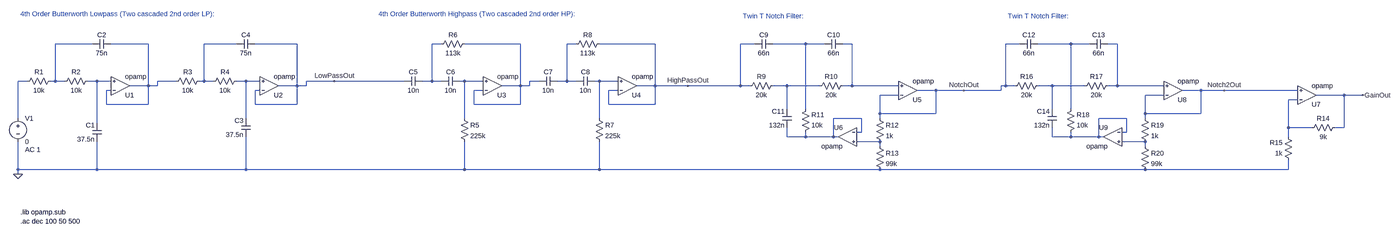
[diagram p0: schematic BMERobotics4thOrderNotch.asc, whole sheet]
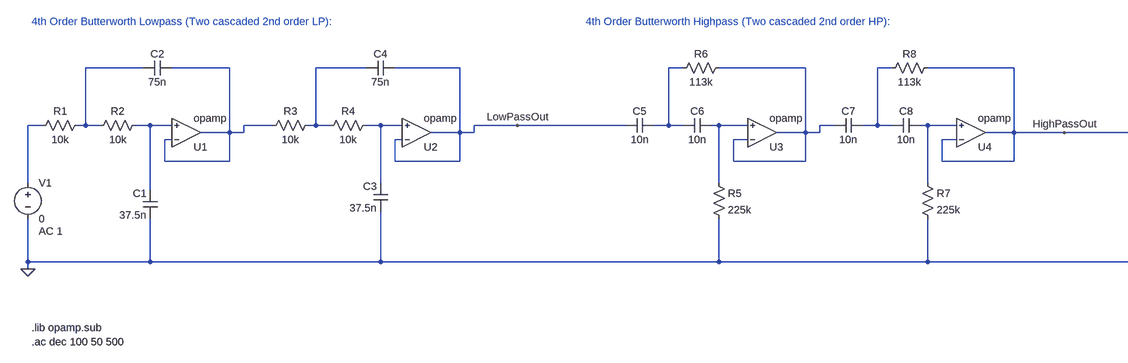
[diagram p1: schematic BMERobotics4thOrderNotch.asc, part, row 1 of 1, column 1 of 2]
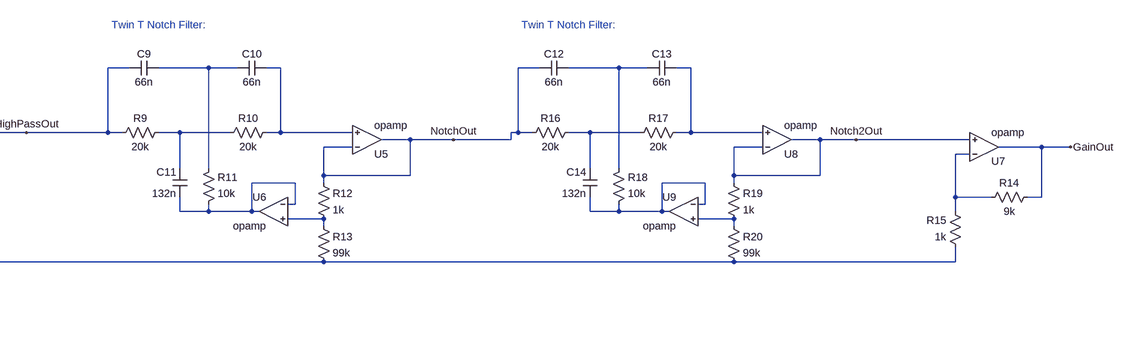
[diagram p2: schematic BMERobotics4thOrderNotch.asc, part, row 1 of 1, column 2 of 2]
BMERobotics4thOrderNotch.asc, the LTspice schematic file:
Version 4
SHEET 1 4608 1124
WIRE 0 0 -128 0
WIRE 192 0 64 0
WIRE 496 0 384 0
WIRE 704 0 560 0
WIRE 1200 0 1168 0
WIRE 1472 0 1280 0
WIRE 1664 0 1632 0
WIRE 1936 0 1744 0
WIRE 2384 0 2336 0
WIRE 2560 0 2448 0
WIRE 2624 0 2560 0
WIRE 2720 0 2688 0
WIRE 3296 0 3248 0
WIRE 3472 0 3360 0
WIRE 3536 0 3472 0
WIRE 3632 0 3600 0
WIRE -224 128 -256 128
WIRE -128 128 -128 0
WIRE -128 128 -144 128
WIRE -96 128 -128 128
WIRE 16 128 -16 128
WIRE 64 128 16 128
WIRE 288 128 224 128
WIRE 384 128 384 0
WIRE 384 128 368 128
WIRE 416 128 384 128
WIRE 528 128 496 128
WIRE 576 128 528 128
WIRE 832 128 736 128
WIRE 1072 128 832 128
WIRE 1168 128 1168 0
WIRE 1168 128 1136 128
WIRE 1200 128 1168 128
WIRE 1280 128 1264 128
WIRE 1344 128 1280 128
WIRE 1536 128 1504 128
WIRE 1632 128 1632 0
WIRE 1632 128 1600 128
WIRE 1664 128 1632 128
WIRE 1744 128 1728 128
WIRE 1808 128 1744 128
WIRE 192 144 192 0
WIRE 192 144 128 144
WIRE 224 144 224 128
WIRE 224 144 192 144
WIRE 704 144 704 0
WIRE 704 144 640 144
WIRE 736 144 736 128
WIRE 736 144 704 144
WIRE 1472 144 1472 0
WIRE 1472 144 1408 144
WIRE 1504 144 1504 128
WIRE 1504 144 1472 144
WIRE 1936 144 1936 0
WIRE 1936 144 1872 144
WIRE 2048 144 1936 144
WIRE 2336 144 2336 0
WIRE 2336 144 2048 144
WIRE 2368 144 2336 144
WIRE 2496 144 2448 144
WIRE 2608 144 2496 144
WIRE 2720 144 2720 0
WIRE 2720 144 2688 144
WIRE 2880 144 2720 144
WIRE 3248 144 3248 0
WIRE 3248 144 3232 144
WIRE 3280 144 3248 144
WIRE 3408 144 3360 144
WIRE 3520 144 3408 144
WIRE 3632 144 3632 0
WIRE 3632 144 3600 144
WIRE 3792 144 3632 144
WIRE 64 160 48 160
WIRE 576 160 560 160
WIRE 1344 160 1312 160
WIRE 1808 160 1776 160
WIRE 3008 160 2944 160
WIRE 3104 160 3008 160
WIRE 3232 160 3232 144
WIRE 3232 160 3104 160
WIRE 3920 160 3856 160
WIRE 4000 160 3920 160
WIRE 4256 160 4000 160
WIRE 2880 176 2816 176
WIRE 3792 176 3728 176
WIRE 4416 176 4320 176
WIRE 4480 176 4416 176
WIRE 4256 192 4224 192
WIRE 48 208 48 160
WIRE 192 208 192 144
WIRE 192 208 48 208
WIRE 560 208 560 160
WIRE 704 208 704 144
WIRE 704 208 560 208
WIRE 1312 208 1312 160
WIRE 1472 208 1472 144
WIRE 1472 208 1312 208
WIRE 1776 208 1776 160
WIRE 1936 208 1936 144
WIRE 1936 208 1776 208
WIRE 2496 224 2496 144
WIRE 2560 224 2560 0
WIRE 3408 224 3408 144
WIRE 3472 224 3472 0
WIRE 2816 240 2816 176
WIRE 3008 240 3008 160
WIRE 3008 240 2816 240
WIRE 3728 240 3728 176
WIRE 3920 240 3920 160
WIRE 3920 240 3728 240
WIRE -256 256 -256 128
WIRE 528 256 528 128
WIRE 1280 256 1280 128
WIRE 1744 256 1744 128
WIRE 2752 256 2656 256
WIRE 2816 256 2816 240
WIRE 3664 256 3568 256
WIRE 3728 256 3728 240
WIRE 16 272 16 128
WIRE 4224 288 4224 192
WIRE 4304 288 4224 288
WIRE 4416 288 4416 176
WIRE 4416 288 4384 288
WIRE 2752 304 2752 256
WIRE 2752 304 2736 304
WIRE 3664 304 3664 256
WIRE 3664 304 3648 304
WIRE 2496 320 2496 288
WIRE 2560 320 2560 304
WIRE 2560 320 2496 320
WIRE 2656 320 2656 256
WIRE 2656 320 2560 320
WIRE 2672 320 2656 320
WIRE 3408 320 3408 288
WIRE 3472 320 3472 304
WIRE 3472 320 3408 320
WIRE 3568 320 3568 256
WIRE 3568 320 3472 320
WIRE 3584 320 3568 320
WIRE 4224 320 4224 288
WIRE 2816 336 2736 336
WIRE 3728 336 3648 336
WIRE 2816 352 2816 336
WIRE 3728 352 3728 336
WIRE -256 432 -256 336
WIRE 16 432 16 336
WIRE 16 432 -256 432
WIRE 528 432 528 320
WIRE 528 432 16 432
WIRE 1280 432 1280 336
WIRE 1280 432 528 432
WIRE 1744 432 1744 336
WIRE 1744 432 1280 432
WIRE 2816 432 1744 432
WIRE 3728 432 2816 432
WIRE 4224 432 4224 400
WIRE 4224 432 3728 432
WIRE -256 448 -256 432
FLAG -256 448 0
FLAG 832 128 LowPassOut
FLAG 2048 144 HighPassOut
FLAG 3104 160 NotchOut
FLAG 4480 176 GainOut
FLAG 4000 160 Notch2Out
SYMBOL cap 32 336 R180
WINDOW 0 24 56 Left 2
WINDOW 3 24 8 Left 2
SYMATTR InstName C1
SYMATTR Value 37.5n
SYMBOL cap 64 -16 R90
WINDOW 0 0 32 VBottom 2
WINDOW 3 32 32 VTop 2
SYMATTR InstName C2
SYMATTR Value 75n
SYMBOL voltage -256 240 R0
WINDOW 123 24 124 Left 2
WINDOW 39 0 0 Left 0
SYMATTR Value2 AC 1
SYMATTR InstName V1
SYMATTR Value 0
SYMBOL OpAmps\\opamp 96 208 M180
SYMATTR InstName U1
SYMBOL res -128 112 R90
WINDOW 0 0 56 VBottom 2
WINDOW 3 32 56 VTop 2
SYMATTR InstName R1
SYMATTR Value 10k
SYMBOL res 0 112 R90
WINDOW 0 0 56 VBottom 2
WINDOW 3 32 56 VTop 2
SYMATTR InstName R2
SYMATTR Value 10k
SYMBOL cap 544 320 R180
WINDOW 0 24 56 Left 2
WINDOW 3 24 8 Left 2
SYMATTR InstName C3
SYMATTR Value 37.5n
SYMBOL cap 560 -16 R90
WINDOW 0 0 32 VBottom 2
WINDOW 3 32 32 VTop 2
SYMATTR InstName C4
SYMATTR Value 75n
SYMBOL OpAmps\\opamp 608 208 M180
SYMATTR InstName U2
SYMBOL res 384 112 R90
WINDOW 0 0 56 VBottom 2
WINDOW 3 32 56 VTop 2
SYMATTR InstName R3
SYMATTR Value 10k
SYMBOL res 512 112 R90
WINDOW 0 0 56 VBottom 2
WINDOW 3 32 56 VTop 2
SYMATTR InstName R4
SYMATTR Value 10k
SYMBOL cap 1136 112 R90
WINDOW 0 0 32 VBottom 2
WINDOW 3 32 32 VTop 2
SYMATTR InstName C5
SYMATTR Value 10n
SYMBOL cap 1264 112 R90
WINDOW 0 0 32 VBottom 2
WINDOW 3 32 32 VTop 2
SYMATTR InstName C6
SYMATTR Value 10n
SYMBOL OpAmps\\opamp 1376 208 M180
SYMATTR InstName U3
SYMBOL res 1264 240 R0
SYMATTR InstName R5
SYMATTR Value 225k
SYMBOL res 1296 -16 R90
WINDOW 0 0 56 VBottom 2
WINDOW 3 32 56 VTop 2
SYMATTR InstName R6
SYMATTR Value 113k
SYMBOL cap 1600 112 R90
WINDOW 0 0 32 VBottom 2
WINDOW 3 32 32 VTop 2
SYMATTR InstName C7
SYMATTR Value 10n
SYMBOL cap 1728 112 R90
WINDOW 0 0 32 VBottom 2
WINDOW 3 32 32 VTop 2
SYMATTR InstName C8
SYMATTR Value 10n
SYMBOL OpAmps\\opamp 1840 208 M180
SYMATTR InstName U4
SYMBOL res 1728 240 R0
SYMATTR InstName R7
SYMATTR Value 225k
SYMBOL res 1760 -16 R90
WINDOW 0 0 56 VBottom 2
WINDOW 3 32 56 VTop 2
SYMATTR InstName R8
SYMATTR Value 113k
SYMBOL cap 2448 -16 R90
WINDOW 0 0 32 VBottom 2
WINDOW 3 32 32 VTop 2
SYMATTR InstName C9
SYMATTR Value 66n
SYMBOL cap 2688 -16 R90
WINDOW 0 0 32 VBottom 2
WINDOW 3 32 32 VTop 2
SYMATTR InstName C10
SYMATTR Value 66n
SYMBOL cap 2512 288 R180
WINDOW 0 24 56 Left 2
WINDOW 3 24 8 Left 2
SYMATTR InstName C11
SYMATTR Value 132n
SYMBOL res 2464 128 R90
WINDOW 0 0 56 VBottom 2
WINDOW 3 32 56 VTop 2
SYMATTR InstName R9
SYMATTR Value 20k
SYMBOL res 2704 128 R90
WINDOW 0 0 56 VBottom 2
WINDOW 3 32 56 VTop 2
SYMATTR InstName R10
SYMATTR Value 20k
SYMBOL res 2544 320 M180
WINDOW 0 36 76 Left 2
WINDOW 3 36 40 Left 2
SYMATTR InstName R11
SYMATTR Value 10k
SYMBOL res 2800 240 R0
SYMATTR InstName R12
SYMATTR Value 1k
SYMBOL res 2800 336 R0
SYMATTR InstName R13
SYMATTR Value 99k
SYMBOL OpAmps\\opamp 2912 224 M180
SYMATTR InstName U5
SYMBOL OpAmps\\opamp 2704 256 M0
SYMATTR InstName U6
SYMBOL OpAmps\\opamp 4288 240 M180
SYMATTR InstName U7
SYMBOL res 4400 272 R90
WINDOW 0 0 56 VBottom 2
WINDOW 3 32 56 VTop 2
SYMATTR InstName R14
SYMATTR Value 9k
SYMBOL res 4240 416 R180
WINDOW 0 36 76 Left 2
WINDOW 3 36 40 Left 2
SYMATTR InstName R15
SYMATTR Value 1k
SYMBOL cap 3360 -16 R90
WINDOW 0 0 32 VBottom 2
WINDOW 3 32 32 VTop 2
SYMATTR InstName C12
SYMATTR Value 66n
SYMBOL cap 3600 -16 R90
WINDOW 0 0 32 VBottom 2
WINDOW 3 32 32 VTop 2
SYMATTR InstName C13
SYMATTR Value 66n
SYMBOL cap 3424 288 R180
WINDOW 0 24 56 Left 2
WINDOW 3 24 8 Left 2
SYMATTR InstName C14
SYMATTR Value 132n
SYMBOL res 3376 128 R90
WINDOW 0 0 56 VBottom 2
WINDOW 3 32 56 VTop 2
SYMATTR InstName R16
SYMATTR Value 20k
SYMBOL res 3616 128 R90
WINDOW 0 0 56 VBottom 2
WINDOW 3 32 56 VTop 2
SYMATTR InstName R17
SYMATTR Value 20k
SYMBOL res 3456 320 M180
WINDOW 0 36 76 Left 2
WINDOW 3 36 40 Left 2
SYMATTR InstName R18
SYMATTR Value 10k
SYMBOL res 3712 240 R0
SYMATTR InstName R19
SYMATTR Value 1k
SYMBOL res 3712 336 R0
SYMATTR InstName R20
SYMATTR Value 99k
SYMBOL OpAmps\\opamp 3824 224 M180
SYMATTR InstName U8
SYMBOL OpAmps\\opamp 3616 256 M0
SYMATTR InstName U9
TEXT -248 592 Left 2 !.lib opamp.sub
TEXT -248 -104 Left 2 ;4th Order Butterworth Lowpass (Two cascaded 2nd order LP):
TEXT 984 -104 Left 2 ;4th Order Butterworth Highpass (Two cascaded 2nd order HP):
TEXT -248 624 Left 2 !.ac dec 100 50 500
TEXT 2344 -96 Left 2 ;Twin T Notch Filter:
TEXT 3256 -96 Left 2 ;Twin T Notch Filter:

The netlist it stands for:
* BMERobotics4thOrderNotch.asc
C1 0 N012 37.5n
C2 N002 N001 75n
V1 N011 0 0 AC 1
XU1 N002 N012 N002 opamp Aol=100K GBW=10Meg  ; pins invin noninvin out
R1 N001 N011 10k
R2 N012 N001 10k
C3 0 N013 37.5n
C4 LowPassOut N003 75n
XU2 LowPassOut N013 LowPassOut opamp Aol=100K GBW=10Meg  ; pins invin noninvin out
R3 N003 N002 10k
R4 N013 N003 10k
C5 N004 LowPassOut 10n
C6 N014 N004 10n
XU3 N005 N014 N005 opamp Aol=100K GBW=10Meg  ; pins invin noninvin out
R5 N014 0 225k
R6 N005 N004 113k
C7 N006 N005 10n
C8 N015 N006 10n
XU4 HighPassOut N015 HighPassOut opamp Aol=100K GBW=10Meg  ; pins invin noninvin out
R7 N015 0 225k
R8 HighPassOut N006 113k
C9 N007 HighPassOut 66n
C10 N008 N007 66n
C11 N019 N016 132n
R9 N016 HighPassOut 20k
R10 N008 N016 20k
R11 N019 N007 10k
R12 NotchOut N021 1k
R13 N021 0 99k
XU5 NotchOut N008 NotchOut opamp Aol=100K GBW=10Meg  ; pins invin noninvin out
XU6 N019 N021 N019 opamp Aol=100K GBW=10Meg  ; pins invin noninvin out
XU7 N018 Notch2Out GainOut opamp Aol=100K GBW=10Meg  ; pins invin noninvin out
R14 GainOut N018 9k
R15 0 N018 1k
C12 N009 NotchOut 66n
C13 N010 N009 66n
C14 N020 N017 132n
R16 N017 NotchOut 20k
R17 N010 N017 20k
R18 N020 N009 10k
R19 Notch2Out N022 1k
R20 N022 0 99k
XU8 Notch2Out N010 Notch2Out opamp Aol=100K GBW=10Meg  ; pins invin noninvin out
XU9 N020 N022 N020 opamp Aol=100K GBW=10Meg  ; pins invin noninvin out
.lib opamp.sub
* 4th Order Butterworth Lowpass (Two cascaded 2nd order LP):
* 4th Order Butterworth Highpass (Two cascaded 2nd order HP):
.ac dec 100 50 500
* Twin T Notch Filter:
* Twin T Notch Filter:
.backanno
.end